# Altium project joint_board.PrjPCB
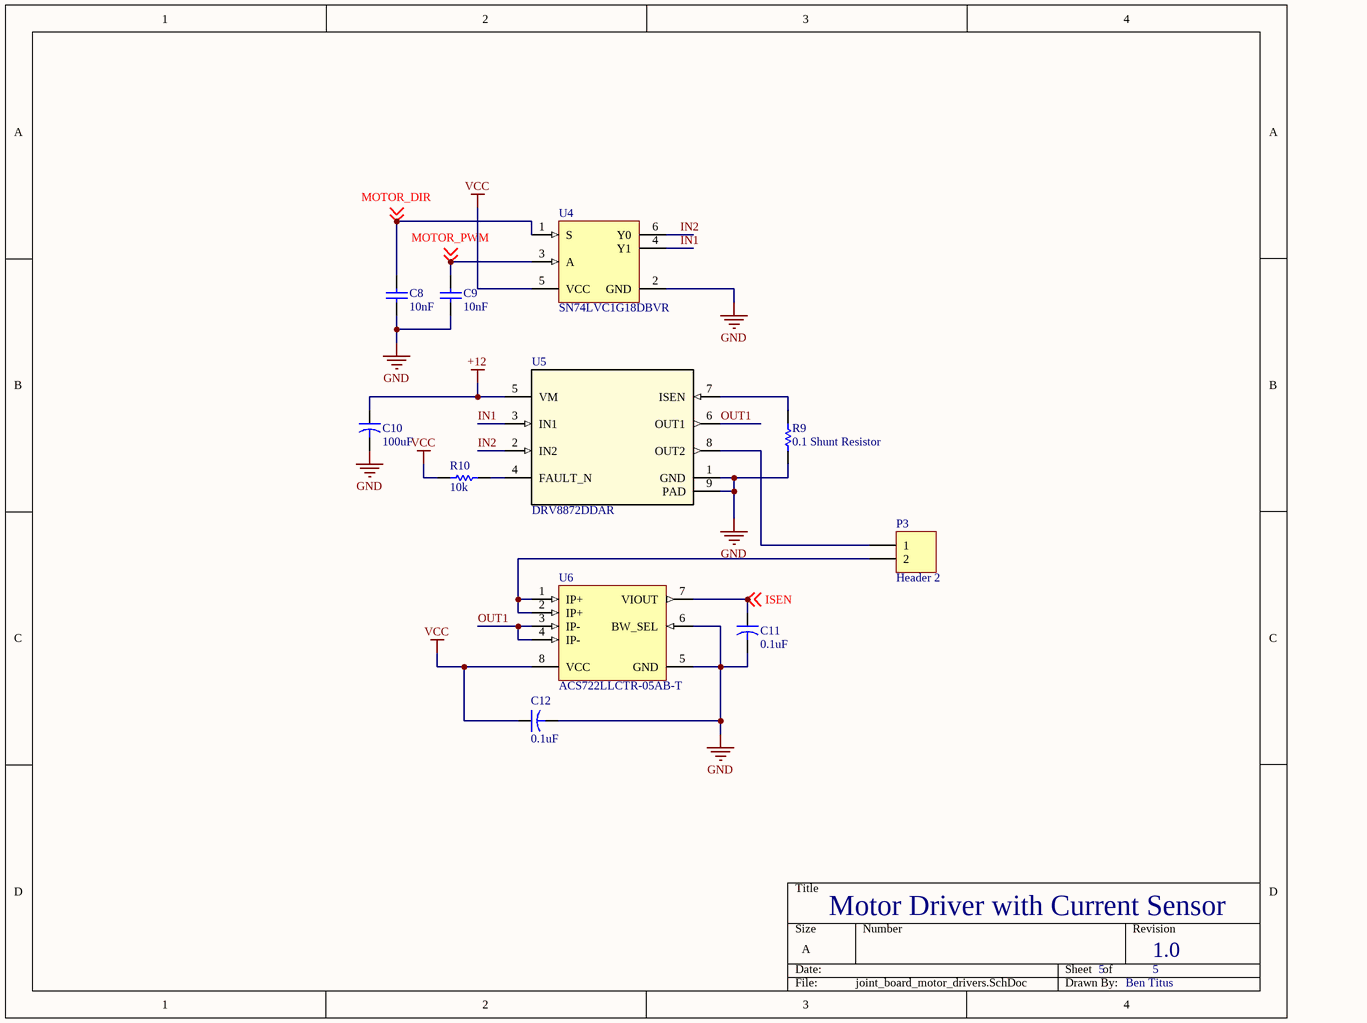
[diagram p0: joint_board_motor_drivers.SchDoc]
5 sheets, 57 parts. Net scope: global (net labels, ports and power ports of the same name join across sheets).
Board file: joint_board.PcbDoc
Sheets:
  joint_board_motor_drivers.SchDoc
  joint_board_load_cell.SchDoc
  joint_board_can.SchDoc
  joint_board_hall_effect_encoder.SchDoc
  joint_board.SchDoc

## Sheet joint_board_motor_drivers.SchDoc
size A; DocumentNumber: 5

### Parts
C8  10nF  [CAPC0805(2012)145_L]
C9  10nF  [CAPC0805(2012)145_L]
C10  100uF  [CAPR5-4X5]
C11  0.1uF  [CAPR5-4X5]
C12  0.1uF  [CAPR5-4X5]
P3  Header 2  [HDR1X2]
R9  0.1 Shunt Resistor  [RESC2512(6432)_L]
R10  10k  [RESC0805(2012)_L]
U4  SN74LVC1G18DBVR  [DBV0006A_L]
U5  DRV8872DDAR  [DDA0008H_N]
U6  ACS722LLCTR-05AB-T  [ALEG-LC-8_V]

### Nets
+12: C10.1 U5.5(VM)
GND: C8.1 C9.1 C10.2 C11.2 C12.2 R9.1 U4.2(GND) U5.1(GND) U5.9(PAD) U6.5(GND) U6.6(BW_SEL)
VCC: C12.1 R10.1 U4.5(VCC) U6.8(VCC)
IN1: U4.4(Y1) U5.3(IN1)
IN2: U4.6(Y0) U5.2(IN2)
ISEN: C11.1 U6.7(VIOUT) ; off-sheet ISEN
MOTOR_DIR: C8.2 U4.1(S) ; off-sheet MOTOR_DIR
MOTOR_PWM: C9.2 U4.3(A) ; off-sheet MOTOR_PWM
OUT1: U5.6(OUT1) U6.3(IP-) U6.4(IP-)
NetP3_1: P3.1 U5.8(OUT2)
NetP3_2: P3.2 U6.1(IP+) U6.2(IP+)
NetR9_2: R9.2 U5.7(ISEN)
NetR10_2: R10.2 U5.4(FAULT_N)

### Notes on the sheet
- Motor Driver with Current Sensor
- 5
- 1.0
- Ben Titus

### Library data of the parts
C8 C9 = CMP-1590-00003-1: 0805 (2012 Metric) Chip Capacitor; Case-EIA: 0805; Case-Metric: 2012; PackageReference: CAPC0805(2012)145
C10 = Cap2: 100uF Filter Capacitor; Published: 23-Sep-2002; PackageReference: CAPR5-4X5; Publisher: Altium Limited; PackageDescription: Capacitor; 2 Leads; Value: 100uF
C11 C12 = Cap2: Capacitor; Published: 23-Sep-2002; PackageReference: CAPR5-4X5; Publisher: Altium Limited; PackageDescription: Capacitor; 2 Leads; Value: 0.1uF
P3 = Header 2: Header, 2-Pin; LatestRevisionDate: 17-Jul-2002; LatestRevisionNote: Re-released for DXP Platform.; Publisher: Altium Limited
R9 = CMP-1591-00007-1: 2512 (6432 Metric) Chip Resistor; Case-EIA: 2512; Case-Metric: 6432; PackageReference: RESC2512(6432)
R10 = CMP-1591-00002-1: 0805 (2012 Metric) Chip Resistor; Case-EIA: 0805; Case-Metric: 2012; PackageReference: RESC0805(2012)
U4 = CMP-0859-00184-3: One of Two Noninverting Demultiplexer with 3-State Deselected Output, DBV0006A, LARGE T&R; Manufacturer: Texas Instruments; Technology Family: LVC; Specialty Logic Family: Decoder/Encoder/Multiplexer; 3-State Output: No; F @ Nom Voltage(Max)(Mhz): 150; VCC(Max)(V): 5.5; Rating: Catalog; Logic: True; Output Type: CMOS; Voltage(Nom)(V): 1.8,2.5,3.3,5; Output Drive (IOL/IOH)(Max)(mA): 32/-32; tpd @ Nom Voltage(Max)(ns): 9.3,5,4.2,3.2; Input Type: CMOS/TTL; Bits(#): 1; ICC @ Nom Voltage(Max)(mA): 0.01; VCC(Min)(V): 1.65; Generic Part Number: SN74LVC1G18; Operating Temperature Range(C): -40 to 85; Sub-Family: Decoder/Encoder/Multiplexer; PackageReference: DBV0006A; DatasheetVersion: SCES406K; Schmitt Trigger: No
U5 = DRV8872DDAR: Imported; Manufacturer: Texas Instruments; CompType: IC; PIN_COUNT: 9; PartNumber: DRV8872DDAR; Alternate_PartNumber: DRV8872DDA; PackageReference: DDA0008H; MountType: SMT; RefDes: RefDes; TYPE: TYPE; Value: Value
U6 = CMP-1557-00006-1: High Accuracy, Galvanically Isolated Current Sensor IC, 3 to 3.6 V, -5 to 5 A IP, -40 to 150 degC, 8-Pin SOIC (LC), RoHS, Tape and Reel; VCC Min: 3 V; IP Max: 5 A; IP Min: -5 A; VCC Max: 3.6 V; ComponentLink3URL: http://www.allegromicro.com/~/media/Files/Datasheets/ACS711-Datasheet.ashx?la=en; RoHS: TRUE; PartNumber: ACS722LLCTR-05AB-T; ComponentLink1Description: Manufacturer URL; ComponentLink1URL: http://www.allegromicro.com/; ComponentLink3Description: Package Specification; Temperature Min: -40 degC; Packing: Tape and Reel; PackageDescription: 8-Pin Small Outline Integrated Package, Body 4.9 x 3.9 mm, Pitch 1.27 mm; ComponentLink2URL: http://www.allegromicro.com/~/media/Files/Datasheets/ACS722-Datasheet.ashx?la=en; Mounting Technology: Surface Mount; Temperature Max: 150 degC; ComponentLink2Description: Datasheet

## Sheet joint_board_load_cell.SchDoc
size A; DocumentNumber: 4
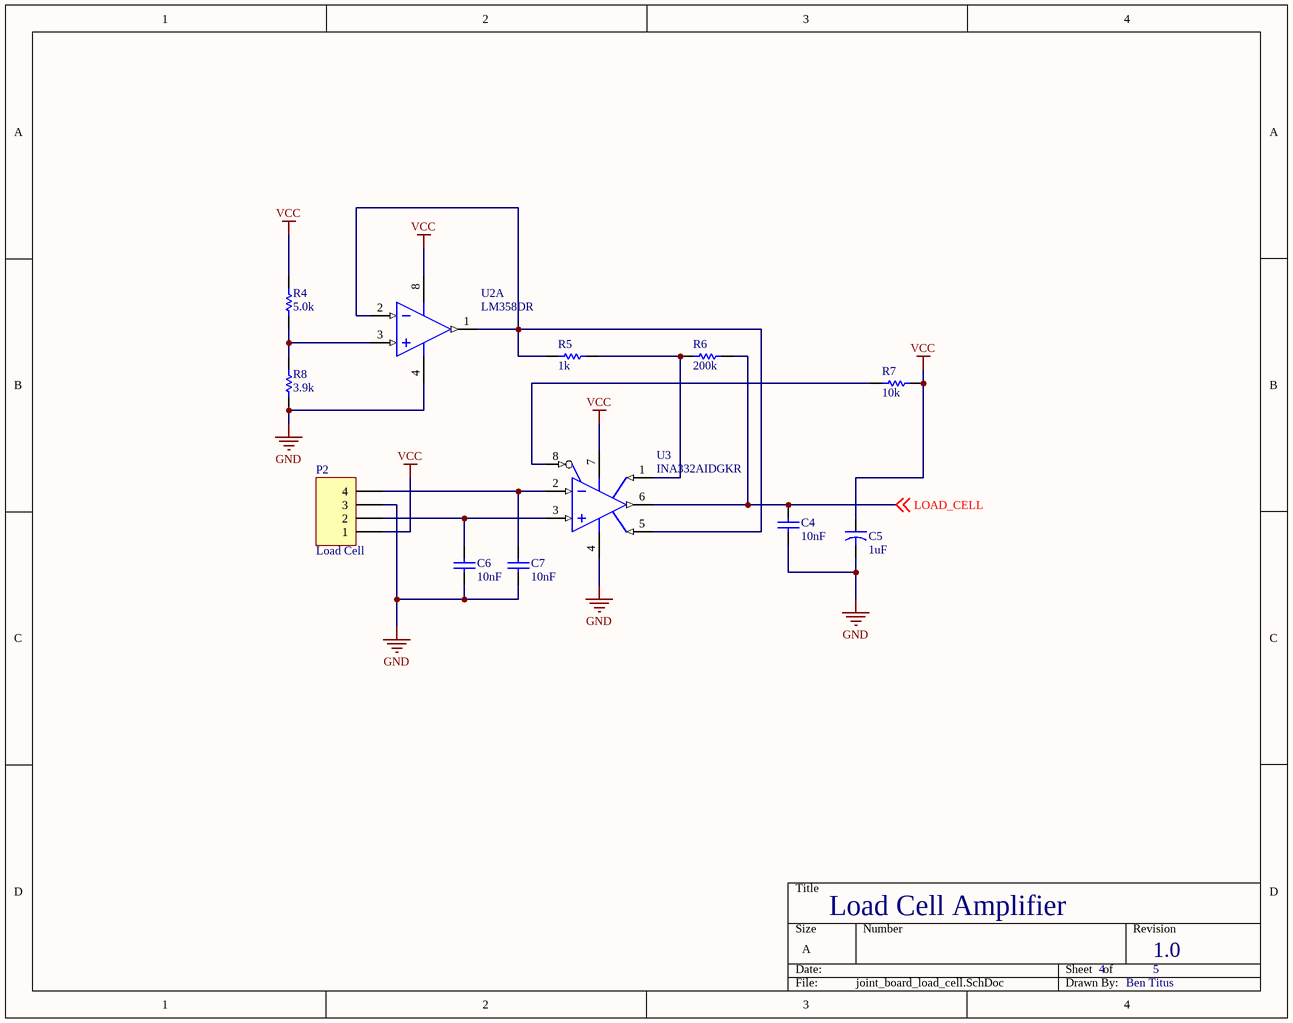
[diagram p1: joint_board_load_cell.SchDoc]

### Parts
C4  10nF  [CAPC0805(2012)145_L]
C5  1uF  [CAPR5-4X5]
C6  10nF  [CAPC0805(2012)145_L]
C7  10nF  [CAPC0805(2012)145_L]
P2  Load Cell  [HDR1X4]
R4  5.0k  [RESC0805(2012)_L]
R5  1k  [RESC0805(2012)_L]
R6  200k  [RESC0805(2012)_L]
R7  10k  [RESC0805(2012)_L]
R8  3.9k  [RESC0805(2012)_L]
U2  LM358DR  [D0008A_L]  (part A of 2)
U3  INA332AIDGKR  [DGK0008A_M]

### Nets
GND: C4.1 C5.2 C6.1 C7.1 P2.3 R8.1 U2.4(GND) U3.4(V-)
VCC: C5.1 P2.1 R4.2 R7.1 U2.8(VCC) U3.7(V+)
LOAD_CELL: C4.2 R6.2 U3.6(VOUT) ; off-sheet LOAD_CELL
NetC6_2: C6.2 P2.2 U3.3(VIN+)
NetC7_2: C7.2 P2.4 U3.2(VIN-)
NetR4_1: R4.1 R8.2 U2.3(1IN+)
NetR5_1: R5.1 U2.1(1OUT) U2.2(1IN-) U3.5(REF)
NetR5_2: R5.2 R6.1 U3.1(RG)
NetR7_2: R7.2 U3.8(SHUTDOWN)

### Notes on the sheet
- Load Cell Amplifier
- 4
- 1.0
- 5
- Ben Titus

### Library data of the parts
C4 C6 C7 = CMP-1590-00003-1: as C8 on sheet joint_board_motor_drivers; PackageReference: CAPC0805(2012)145
C5 = Cap2: Capacitor; Published: 23-Sep-2002; PackageReference: CAPR5-4X5; Publisher: Altium Limited; PackageDescription: Capacitor; 2 Leads; Value: 1uF
P2 = Header 4: Header, 4-Pin; LatestRevisionDate: 17-Jul-2002; LatestRevisionNote: Re-released for DXP Platform.; Publisher: Altium Limited
R4-R8 = CMP-1591-00002-1: as R10 on sheet joint_board_motor_drivers; PackageReference: RESC0805(2012)
U2 = CMP-1685-00009-1: Dual Operational Amplifier, 3 to 32 V, 0 to 70 degC, 8-Pin SOIC (D), Green (RoHS & no Sb/Br), Tape and Reel; DatasheetVersion: SLOS068T, 04/2015; ComponentLink1URL: http://www.ti.com/; ComponentLink2URL: http://www.ti.com/lit/ds/symlink/lm358.pdf; ComponentLink3Description: Package Specification; Code_JEDEC: MS-012; PackageDescription: 8-Pin Small Outline Integrated Circuit, Body 4.9 x 3.9 mm, Pitch 1.27 mm; ComponentLink2Description: Datasheet; PackageVersion: 4040047-3/M, 06/2011; ComponentLink1Description: Manufacturer URL; ComponentLink3URL: http://www.ti.com/lit/ml/msoi002j/msoi002j.pdf; PackageReference: D0008A
U3 = CMP-0944-00077-2: Low-Power, Single Supply, CMOS, Low Cost, Instrumentation Amplifier, -55 to 125 degC, 8-pin SOP (DGK8), Green (RoHS & no Sb/Br); Manufacturer: Texas Instruments; Noise at 1kHz(Typ)(nV/rt(Hz)): 46; Quiescent Current (+/-)(Typ)(mA): 0.415; Gain(V/V): 5 to 1000; Vs(Min)(V): 2.5; Number of Channels: 1; Vs(Max)(V): 5.5; CMRR(Min)(dB): 60; Input Bias Current (+/-)(Max)(nA): 0.01; Input Offset (+/-)(Max)(uV): 8000; DatasheetVersion: SBOS216B; ComponentLink3URL: http://www.ti.com/litv/pdf/mpds028d; PartNumber: INA332AIDGKR; ComponentLink2Description: Datasheet; ComponentLink1URL: http://www.ti.com/; ComponentLink1Description: Manufacturer URL; Code_JEDEC: MO-187; SubFamily: Single Supply; ComponentLink3Description: Package Specification; Mounting Technology: Surface Mount; PackageReference: DGK0008A; PackageDescription: 8-Pin Thin Small Outline, Body 3 x 3 mm, Pitch 0.65 mm; PackageVersion: 4073329/E, 05/2006; Eco-Plan: Green (RoHS & no Sb/Br); Non-Linearity (+/-)(Max)(%): 0.01; ComponentLink2URL: http://www.ti.com/general/docs/lit/getliterature.tsp?genericPartNumber=INA332&fileType=pdf

## Sheet joint_board_can.SchDoc
size A; DocumentNumber: 2
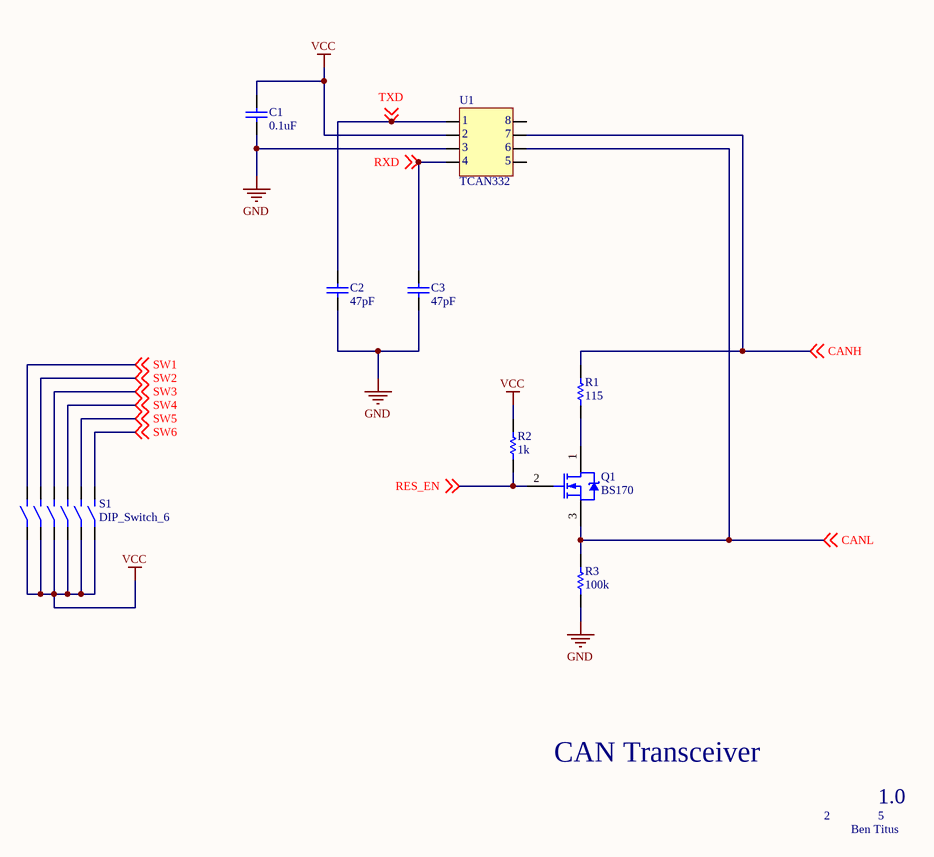
[diagram p2: joint_board_can.SchDoc]

### Parts
C1  0.1uF  [CAPC0805(2012)145_L]
C2  47pF  [CAPC0805(2012)145_L]
C3  47pF  [CAPC0805(2012)145_L]
Q1  BS170  [SOT23-3]
R1  115  [RESC0805(2012)_L]
R2  1k  [RESC0805(2012)_L]
R3  100k  [RESC0805(2012)_L]
S1  DIP_Switch_6  [SOP12]
U1  TCAN332  [SOP8]

### Nets
GND: C1.1 C2.1 C3.1 R3.1 U1.3
VCC: C1.2 R2.2 S1.1 S1.2 S1.3 S1.4 S1.5 S1.6 U1.2
CANH: R1.2 U1.7 ; off-sheet CANH
CANL: Q1.3(S) R3.2 U1.6 ; off-sheet CANL
RES_EN: Q1.2(G) R2.1 ; off-sheet RES_EN
RXD: C3.2 U1.4 ; off-sheet RXD
SW1: S1.12 ; off-sheet SW1
SW2: S1.11 ; off-sheet SW2
SW3: S1.10 ; off-sheet SW3
SW4: S1.9 ; off-sheet SW4
SW5: S1.8 ; off-sheet SW5
SW6: S1.7 ; off-sheet SW6
TXD: C2.2 U1.1 ; off-sheet TXD
NetQ1_1: Q1.1(D) R1.1

Not connected (* = marked no-connect by the designer): U1 5 8

### Notes on the sheet
- CAN Transceiver
- 2
- 1.0
- 5
- Ben Titus

### Library data of the parts
C1-C3 = CMP-1590-00003-1: as C8 on sheet joint_board_motor_drivers; PackageReference: CAPC0805(2012)145
Q1 = BS170: Small Signal MOSFET, 500 mA, 60 V, N-Channel, 3-Pin TO-92, Bulk Box; pin to pad: 1>3 2>1 3>2; Manufacturer: On Semiconductor; Channel Polarity: N Channel; Configuration: Single; ID Max (A): 0.5; PD Max (W): 0.35; V(BR)DSS Min (V): 60; VGS Max (V): 20; VGS(th) Max (V): 3; DatasheetVersion: Rev. 6; PackageVersion: Rev. AM; PackageReference: TO-92-3-29-11_AM_SL; PackageDescription: 3-Pin Transistor Outline, Body 4.825 x 3.685 mm, Pitch 1.27 mm; Supplier 1: Digi-Key; Supplier Part Number 1: BS170OS-ND; Package Type: TO-92; Packing: Bulk Box; Mounting Technology: Through Hole; PartNumber: BS170; ComponentLink1Description: Manufacturer URL; ComponentLink1URL: http://www.onsemi.com/; ComponentLink2Description: Datasheet; ComponentLink2URL: http://www.onsemi.com/pub_link/Collateral/BS170-D.PDF; ComponentLink3Description: Package Specification; ComponentLink3URL: http://www.onsemi.cn/pub_link/Collateral/2N6426-D.PDF
R1-R3 = CMP-1591-00002-1: as R10 on sheet joint_board_motor_drivers; PackageReference: RESC0805(2012)
S1 = DIP_Switch_6: 6 pin DIP switch
U1 = TCAN332: 3.3V CAN Transceiver

## Sheet joint_board_hall_effect_encoder.SchDoc
size A; DocumentNumber: 3
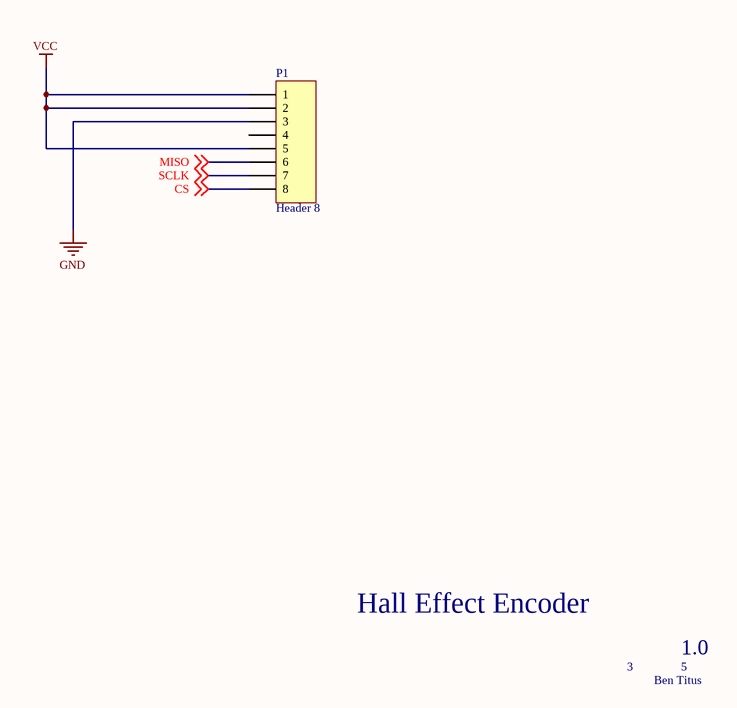
[diagram p3: joint_board_hall_effect_encoder.SchDoc]

### Parts
P1  Header 8  [HDR1X8]

### Nets
GND: P1.3
VCC: P1.1 P1.2 P1.5
CS: P1.8 ; off-sheet CS
MISO: P1.6 ; off-sheet MISO
SCLK: P1.7 ; off-sheet SCLK

Not connected (* = marked no-connect by the designer): P1 4

### Notes on the sheet
- Hall Effect Encoder
- 3
- 1.0
- 5
- Ben Titus

### Library data of the parts
P1 = Header 8: Header, 8-Pin; LatestRevisionDate: 17-Jul-2002; LatestRevisionNote: Re-released for DXP Platform.; Publisher: Altium Limited

## Sheet joint_board.SchDoc
size A; Engineer: Ben Titus; DocumentNumber: 1; Revision: 1.0; SheetNumber: 1
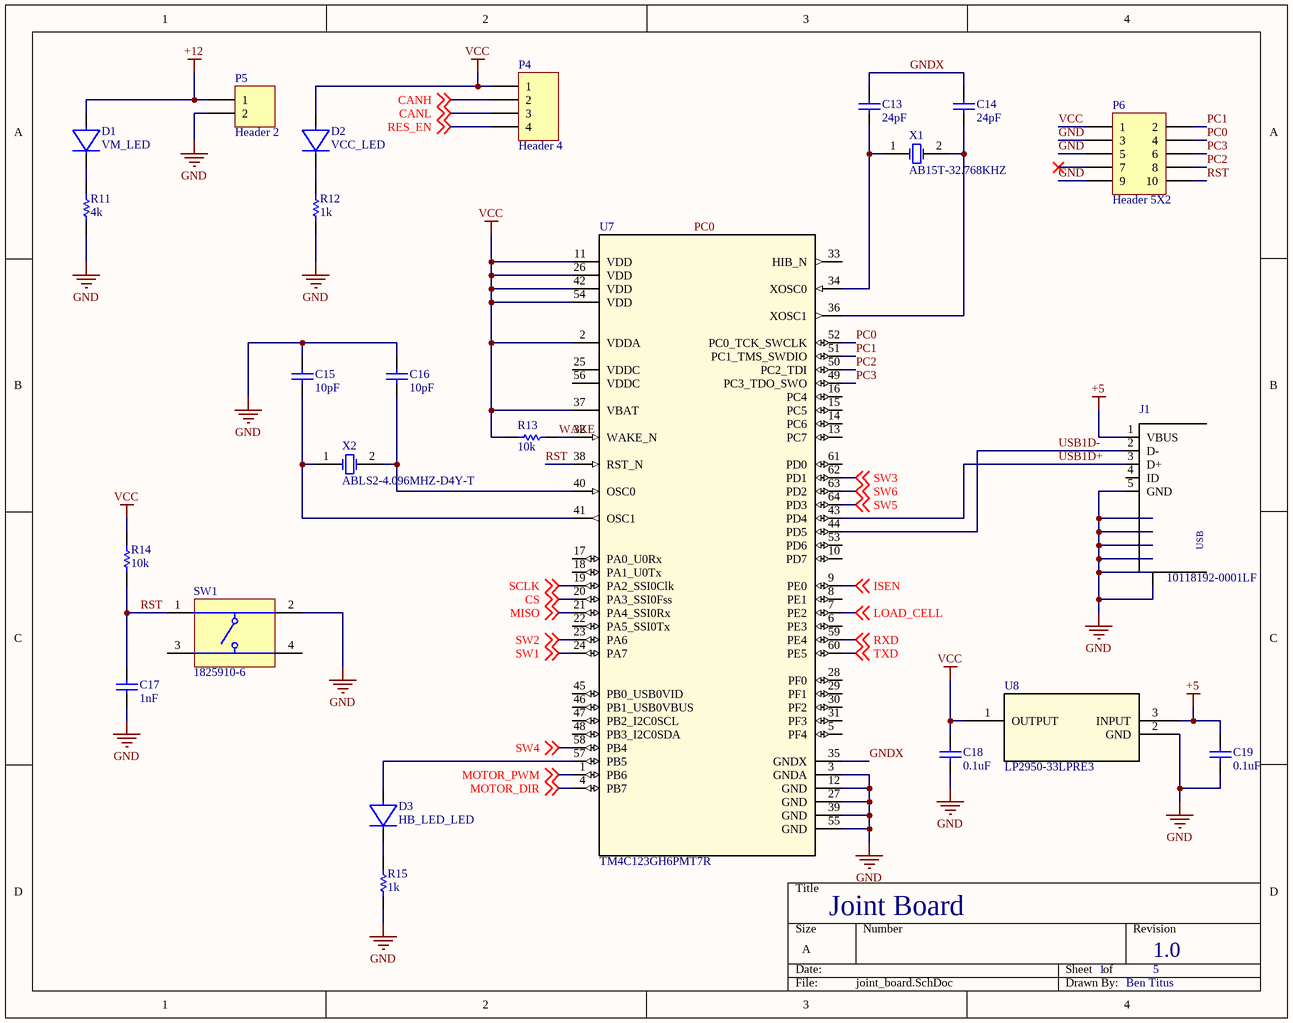
[diagram p4: joint_board.SchDoc]

### Parts
C13  24pF  [CAPC0805(2012)145_L]
C14  24pF  [CAPC0805(2012)145_L]
C15  10pF  [CAPC0805(2012)145_L]
C16  10pF  [CAPC0805(2012)145_L]
C17  1nF  [CAPC0805(2012)145_L]
C18  0.1uF  [CAPC0805(2012)145_L]
C19  0.1uF  [CAPC0805(2012)145_L]
D1  VM_LED  [0805 Diode]
D2  VCC_LED  [0805 Diode]
D3  HB_LED_LED  [0805 Diode]
J1  10118192-0001LF  [10118192-0001LF_10118192-0001LF(Primary)]
P4  Header 4  [HDR1X4]
P5  Header 2  [HDR1X2]
P6  Header 5X2  [HDR2X5]
R11  4k  [RESC0805(2012)_L]
R12  1k  [RESC0805(2012)_L]
R13  10k  [RESC0805(2012)_L]
R14  10k  [RESC0805(2012)_L]
R15  1k  [RESC0805(2012)_L]
SW1  1825910-6  [TECO-1825910-6_V]
U7  TM4C123GH6PMT7R  [PM0064A_N]
U8  LP2950-33LPRE3  [LP3]
X1  AB15T-32.768KHZ  [ABRA-AB15T-2_V]
X2  ABLS2-4.096MHZ-D4Y-T  [ABRA-ABLS2-2_V]

### Nets
+5: C19.2 J1.1(VBUS) U8.3(INPUT)
+12: D1.1 P5.1
GND: C15.2 C16.2 C17.1 C18.1 C19.1 J1.5(GND) J1.M1(S) J1.M2(S) J1.S1(S) J1.S2(S) J1.S3(S) J1.S4(S) P5.2 P6.3 P6.5 P6.9 R11.1 R12.1 R15.1 SW1.2 U7.3(GNDA) U7.12(GND) U7.27(GND) U7.39(GND) U7.55(GND) U8.2(GND)
VCC: C18.2 D2.1 P4.1 P6.1 R13.1 R14.2 U7.2(VDDA) U7.11(VDD) U7.26(VDD) U7.37(VBAT) U7.42(VDD) U7.54(VDD) U8.1(OUTPUT)
CANH: P4.2 ; off-sheet CANH
CANL: P4.3 ; off-sheet CANL
CS: U7.20(PA3_SSI0Fss) ; off-sheet CS
GNDX: C13.2 C14.2 U7.35(GNDX)
ISEN: U7.9(PE0) ; off-sheet ISEN
LOAD_CELL: U7.7(PE2) ; off-sheet LOAD_CELL
MISO: U7.21(PA4_SSI0Rx) ; off-sheet MISO
MOTOR_DIR: U7.4(PB7) ; off-sheet MOTOR_DIR
MOTOR_PWM: U7.1(PB6) ; off-sheet MOTOR_PWM
PC0: P6.4 U7.52(PC0_TCK_SWCLK)
PC1: P6.2 U7.51(PC1_TMS_SWDIO)
PC2: P6.8 U7.50(PC2_TDI)
PC3: P6.6 U7.49(PC3_TDO_SWO)
RES_EN: P4.4 ; off-sheet RES_EN
RST: C17.2 P6.10 R14.1 SW1.1 U7.38(RST_N)
RXD: U7.59(PE4) ; off-sheet RXD
SCLK: U7.19(PA2_SSI0Clk) ; off-sheet SCLK
SW1: U7.24(PA7) ; off-sheet SW1
SW2: U7.23(PA6) ; off-sheet SW2
SW3: U7.62(PD1) ; off-sheet SW3
SW4: U7.58(PB4) ; off-sheet SW4
SW5: U7.64(PD3) ; off-sheet SW5
SW6: U7.63(PD2) ; off-sheet SW6
TXD: U7.60(PE5) ; off-sheet TXD
USB1D+: J1.3(D+) U7.43(PD4)
USB1D-: J1.2(D-) U7.44(PD5)
WAKE: R13.2 U7.32(WAKE_N)
NetC13_1: C13.1 U7.34(XOSC0) X1.1(X1)
NetC14_1: C14.1 U7.36(XOSC1) X1.2(X2)
NetC15_1: C15.1 U7.41(OSC1) X2.1(X1)
NetC16_1: C16.1 U7.40(OSC0) X2.2(X2)
NetD1_2: D1.2 R11.2
NetD2_2: D2.2 R12.2
NetD3_1: D3.1 U7.57(PB5)
NetD3_2: D3.2 R15.2

Not connected (* = marked no-connect by the designer): J1 4(ID); P6 7*; SW1 3 4; U7 5(PF4) 6(PE3) 8(PE1) 10(PD7) 13(PC7) 14(PC6) 15(PC5) 16(PC4) 17(PA0_U0Rx) 18(PA1_U0Tx) 22(PA5_SSI0Tx) 25(VDDC) 28(PF0) 29(PF1) 30(PF2) 31(PF3) 33(HIB_N) 45(PB0_USB0VID) 46(PB1_USB0VBUS) 47(PB2_I2C0SCL) 48(PB3_I2C0SDA) 53(PD6) 56(VDDC) 61(PD0)

### Notes on the sheet
- Joint Board
- 1
- 1.0
- 5
- Ben Titus
- Labels drawn without touching a wire or pin: PC0
- (in symbol 10118192-0001LF) USB

### Library data of the parts
C13-C19 = CMP-1590-00003-1: as C8 on sheet joint_board_motor_drivers; PackageReference: CAPC0805(2012)145
D1-D3 = SMD_LED
J1 = 10118192-0001LF: CONN USB MICRO B RECPT SMT R/A; MF: Amphenol; Package: None; Price: 0.22 USD; MP: 10118192-0001LF; Availability: Good; Value: *
P4 = Header 4: Header, 4-Pin; LatestRevisionDate: 17-Jul-2002; LatestRevisionNote: Re-released for DXP Platform.; Publisher: Altium Limited
P5 = Header 2: Header, 2-Pin; LatestRevisionDate: 17-Jul-2002; LatestRevisionNote: Re-released for DXP Platform.; Publisher: Altium Limited
P6 = Header 5X2: Header, 5-Pin, Dual row; LatestRevisionDate: 17-Jul-2002; LatestRevisionNote: Re-released for DXP Platform.; Publisher: Altium Limited
R11-R15 = CMP-1591-00002-1: as R10 on sheet joint_board_motor_drivers; PackageReference: RESC0805(2012)
SW1 = CMP-1684-00021-1: Tact Switch, SPST-NO, 0.05 A, -35 to 85 degC, 4-Pin THD, RoHS, Bulk; Manufacturer: TE Connectivity; Maximum Contact Resistance: 100mOhm; Mechanical Life: 100000Cycles; Bushing Type: Unthreaded; Switch Configuration: OFF(ON); Maximum DC Voltage Rating: 24V; Contact Rating @ Voltage: 0.05A@24VDC; Actuator Color: Black; Body Orientation: Straight; Function: MomentaryContact; Illumination: N/R; Actuator Style: RoundButton; Actuator Material: PolybutyleneTerephthalate; Dielectric Strength: 500VAC; Pole Throw Configuration: SPST; Actuator Length: 1.4mm; Product Weight: N/A; Contact Material: CopperAlloy; Housing Material: N/A; Terminal Type: PCPins; Minimum Insulation Resistance: 100MOhm; Package Description: 4-Pin Through Hole Device, Body 5.99 x 5.99 mm, Pitch 6.5 mm; Part No: 1825910-6; Package Reference: THD; Base Material: N/A; Manufacturer URL: http://www.te.com; Contact Plating: Silver; RoHS: Yes; Datasheet Version: Rev. C9; Electrical Life: 100000Cycles; Maximum AC Voltage Rating: N/A; Thread Size: N/R; Operating Temperature: -35to85C; Mounting: ThroughHole; Dimension: 5.99x5mm; Datasheet URL: http://www.te.com/commerce/DocumentDelivery/DDEController?Action=showdoc&DocId=Customer+Drawing%7F1825910%7FC9%7Fpdf%7FEnglish%7FENG_CD_1825910_C9.pdf%7F1825910-6; Family: 1825910; Seal Location: N/A; Seal Description: N/A; Packaging: N/A
U7 = TM4C123GH6PMT7R: Imported; PartNumber: TM4C123GH6PMTR; Manufacturer: Texas Instruments; CompType: IC; PIN_COUNT: 64; Application_BuildNumber: *; Alternate_PartNumber: TM4C123GH6PMT; PackageReference: PM0064A; MountType: SMT; RoHS: Y; RefDes: RefDes; TYPE: TYPE; Value: Value
U8 = LP2950-33LPRE3: Imported; Manufacturer: Texas Instruments; Built_By: EMA_UL_Team; C: Copyright (C) 2015 Accelerated Designs. All rights reserved; Vendor: Texas Instruments; Manufacturer_Part_Number: LP2950-33LPRE3; Value: Value; Type: Type; RefDes: RefDes
X1 = CMP-1326-00001-1: Low Frequency Cylindrical Watch Crystal, 32.768 kHz, -20 to 70 degC, 2-Pin 5 x 1.4 x 1.5 mm THD, RoHS, Bulk; Manufacturer: Abracon; ESR: 40 KOhm Max.; Shunt Capacitance C0: 1 pF Typ.; Load Capacitance CL: 12.5 pF; ComponentLink1URL: http://www.abracon.com/; Temperature Range: -20 to 70 degC; ComponentLink1Description: Manufacturer URL; PackageDescription: 2-Pin THD, Body 5 x 1.4 mm, Pin Spacing 0.45 mm; Frequency: 32.768 kHz; ComponentLink2URL: http://www.abracon.com/Resonators/AB15T.pdf; ComponentLink2Description: Datasheet; ComponentLink3Description: Package Specification; DatasheetVersion: Jun-10; Packing: Bulk; Mounting Technology: Through Hole; RoHS: TRUE; PartNumber: AB15T-32.768KHZ; ComponentLink3URL: http://www.abracon.com/Resonators/AB15T.pdf
X2 = CMP-0277-00002-1: Low Profile Surface Mount Microprocessor Crystal, 4.096 MHz +/-30 ppm, 180 Ohm, -40 to 85 degC, 2-Pin 11.4 x 4.7 x 3.3 mm SMD, RoHS, Tape and Reel; Manufacturer: Abracon; Operation Mode: Fundamental or 3rd Overtone; Shunt Capacitance: 7 pF Max.; ESR: 180 Ohm; Load Capacitance: 18 pF; Mounting Technology: Surface Mount; PackageDescription: 2-Pin SMD, Body 11.4 x 4.7 mm, Height 3.3 mm; ComponentLink1URL: http://www.abracon.com/; Freq. Stability: +/- 30 ppm; ComponentLink2Description: Datasheet; PartNumber: ABLS2-4.096MHZ-D4Y-T; Operating Temp. Range: -40 to 85 degC; Packing: Tape and Reel; RoHS: TRUE; PackageReference: ABLS2-2; DatasheetVersion: Rev. 03.31.11; Freq. Tolerance: +/- 30 ppm; Frequency: 4.096 MHz; ComponentLink2URL: http://www.abracon.com/Resonators/ABLS2.pdf; ComponentLink1Description: Manufacturer URL

## Nets that join several sheets
+12: joint_board_motor_drivers (C10.1 U5.5), joint_board (D1.1 P5.1)
GND: joint_board_motor_drivers (11 pins), joint_board_load_cell (8 pins), joint_board_can (5 pins), joint_board_hall_effect_encoder (P1.3), joint_board (26 pins)
VCC: joint_board_motor_drivers (C12.1 R10.1 U4.5 U6.8), joint_board_load_cell (6 pins), joint_board_can (9 pins), joint_board_hall_effect_encoder (P1.1 P1.2 P1.5), joint_board (13 pins)
CANH: joint_board_can (R1.2 U1.7), joint_board (P4.2)
CANL: joint_board_can (Q1.3 R3.2 U1.6), joint_board (P4.3)
CS: joint_board_hall_effect_encoder (P1.8), joint_board (U7.20)
ISEN: joint_board_motor_drivers (C11.1 U6.7), joint_board (U7.9)
LOAD_CELL: joint_board_load_cell (C4.2 R6.2 U3.6), joint_board (U7.7)
MISO: joint_board_hall_effect_encoder (P1.6), joint_board (U7.21)
MOTOR_DIR: joint_board_motor_drivers (C8.2 U4.1), joint_board (U7.4)
MOTOR_PWM: joint_board_motor_drivers (C9.2 U4.3), joint_board (U7.1)
RES_EN: joint_board_can (Q1.2 R2.1), joint_board (P4.4)
RXD: joint_board_can (C3.2 U1.4), joint_board (U7.59)
SCLK: joint_board_hall_effect_encoder (P1.7), joint_board (U7.19)
SW1: joint_board_can (S1.12), joint_board (U7.24)
SW2: joint_board_can (S1.11), joint_board (U7.23)
SW3: joint_board_can (S1.10), joint_board (U7.62)
SW4: joint_board_can (S1.9), joint_board (U7.58)
SW5: joint_board_can (S1.8), joint_board (U7.64)
SW6: joint_board_can (S1.7), joint_board (U7.63)
TXD: joint_board_can (C2.2 U1.1), joint_board (U7.60)